# Altium schematic sheet 6_eMMC.SchDoc
size A4
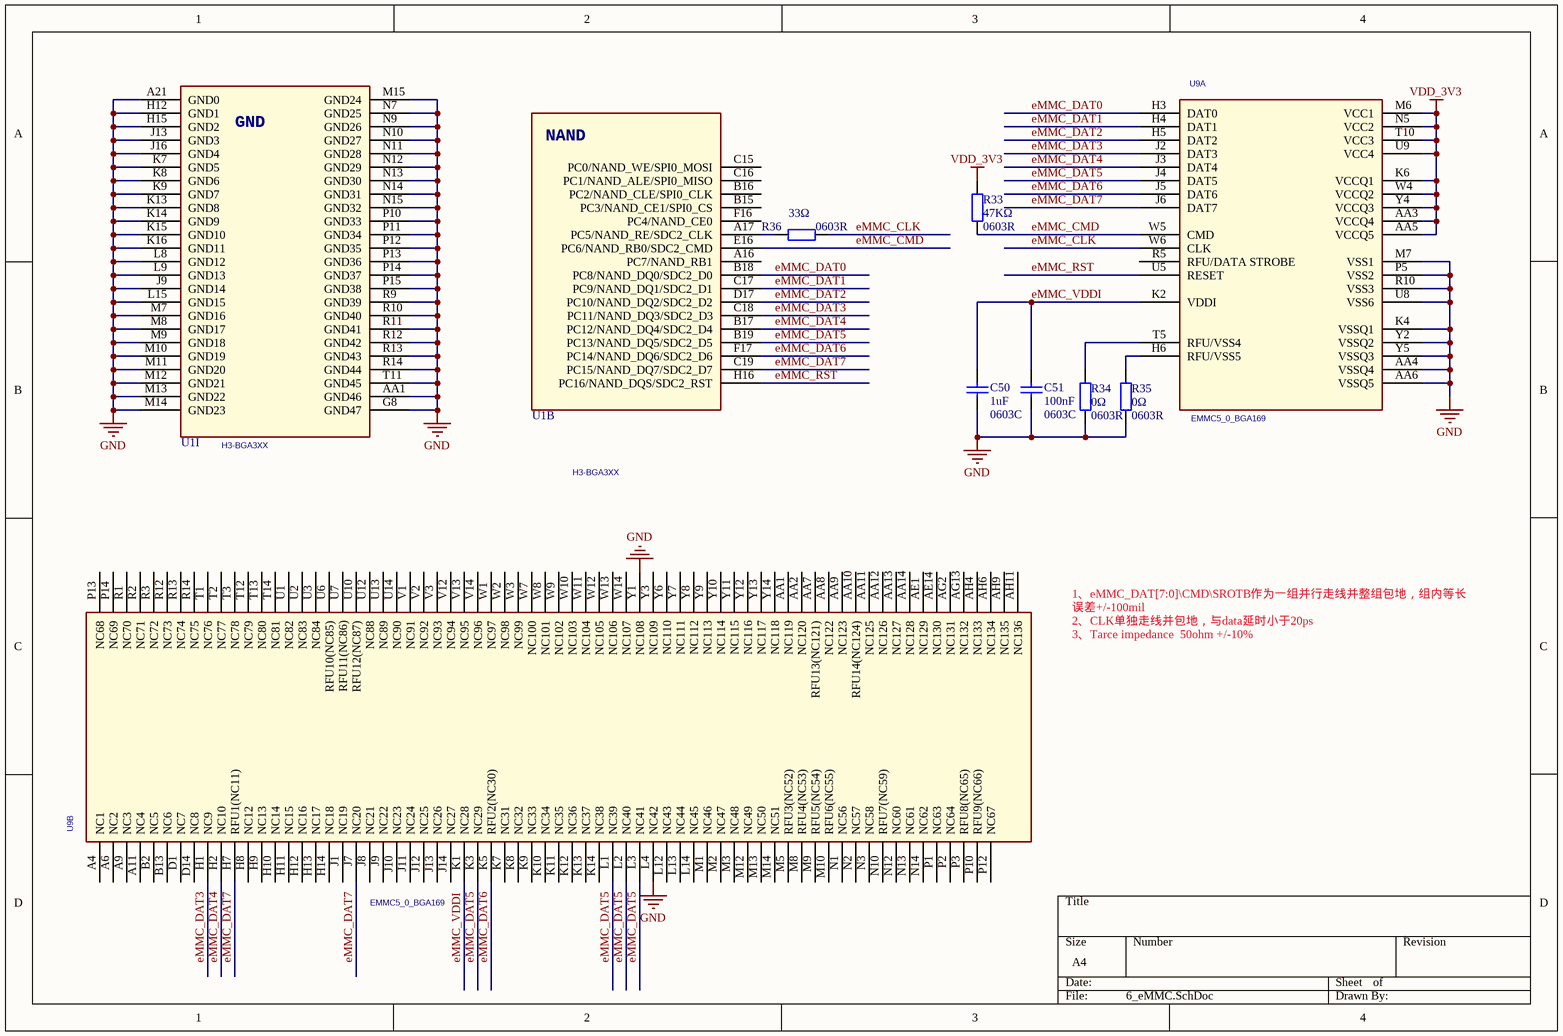
[diagram p0: 6_eMMC.SchDoc]

## Parts
C50  1uF  Package: 0603C  [0603_C]
C51  100nF  Package: 0603C  [0603_C]
R33  47KΩ  Package: 0603R  [0603_R]
R34  0Ω  Package: 0603R  [0603_R]
R35  0Ω  Package: 0603R  [0603_R]
R36  33Ω  Package: 0603R  [0603_R]
U1  H3-BGA3XX  [BGA347P0_65B14X14]  (parts B,I of 9)
U9  EMMC5_0_BGA169  [BGA169P0_50B12_00X16_00H1_00]  (parts A,B of 2)

## Nets
GND: C50.2 C51.2 R34.2 R35.2 U1.A21(GND0) U1.AA1(GND46) U1.G8(GND47) U1.H12(GND1) U1.H15(GND2) U1.J9(GND14) U1.J13(GND3) U1.J16(GND4) U1.K7(GND5) U1.K8(GND6) U1.K9(GND7) U1.K13(GND8) U1.K14(GND9) U1.K15(GND10) U1.K16(GND11) U1.L8(GND12) U1.L9(GND13) U1.L15(GND15) U1.M7(GND16) U1.M8(GND17) U1.M9(GND18) U1.M10(GND19) U1.M11(GND20) U1.M12(GND21) U1.M13(GND22) U1.M14(GND23) U1.M15(GND24) U1.N7(GND25) U1.N9(GND26) U1.N10(GND27) U1.N11(GND28) U1.N12(GND29) U1.N13(GND30) U1.N14(GND31) U1.N15(GND32) U1.P10(GND33) U1.P11(GND34) U1.P12(GND35) U1.P13(GND36) U1.P14(GND37) U1.P15(GND38) U1.R9(GND39) U1.R10(GND40) U1.R11(GND41) U1.R12(GND42) U1.R13(GND43) U1.R14(GND44) U1.T11(GND45) U9.AA4(VSSQ4) U9.AA6(VSSQ5) U9.K4(VSSQ1) U9.L4(NC42) U9.M7(VSS1) U9.P5(VSS2) U9.R10(VSS3) U9.U8(VSS6) U9.Y1(NC108) U9.Y2(VSSQ2) U9.Y5(VSSQ3)
VDD_3V3: R33.1 U9.AA3(VCCQ4) U9.AA5(VCCQ5) U9.K6(VCCQ1) U9.M6(VCC1) U9.N5(VCC2) U9.T10(VCC3) U9.U9(VCC4) U9.W4(VCCQ2) U9.Y4(VCCQ3)
eMMC_CLK: R36.2 U9.W6(CLK)
eMMC_CMD: R33.2 U1.E16(PC6/NAND_RB0/SDC2_CMD) U9.W5(CMD)
eMMC_DAT0: U1.B18(PC8/NAND_DQ0/SDC2_D0) U9.H3(DAT0)
eMMC_DAT1: U1.C17(PC9/NAND_DQ1/SDC2_D1) U9.H4(DAT1)
eMMC_DAT2: U1.D17(PC10/NAND_DQ2/SDC2_D2) U9.H5(DAT2)
eMMC_DAT3: U1.C18(PC11/NAND_DQ3/SDC2_D3) U9.H1(NC9) U9.J2(DAT3)
eMMC_DAT4: U1.B17(PC12/NAND_DQ4/SDC2_D4) U9.H2(NC10) U9.J3(DAT4)
eMMC_DAT5: U1.B19(PC13/NAND_DQ5/SDC2_D5) U9.J4(DAT5) U9.K3(NC29) U9.L1(NC39) U9.L2(NC40) U9.L3(NC41)
eMMC_DAT6: U1.F17(PC14/NAND_DQ6/SDC2_D6) U9.J5(DAT6) U9.K5(RFU2(NC30))
eMMC_DAT7: U1.C19(PC15/NAND_DQ7/SDC2_D7) U9.H7(RFU1(NC11)) U9.J6(DAT7) U9.J7(NC20)
eMMC_RST: U1.H16(PC16/NAND_DQS/SDC2_RST) U9.U5(RESET)
eMMC_VDDI: C50.1 C51.1 U9.K1(NC28) U9.K2(VDDI)
NetR34_1: R34.1 U9.T5(RFU/VSS4)
NetR35_1: R35.1 U9.H6(RFU/VSS5)
NetR36_1: R36.1 U1.A17(PC5/NAND_RE/SDC2_CLK)

Not connected (* = marked no-connect by the designer): U1 A16(PC7/NAND_RB1) B15(PC3/NAND_CE1/SPI0_CS) B16(PC2/NAND_CLE/SPI0_CLK) C15(PC0/NAND_WE/SPI0_MOSI) C16(PC1/NAND_ALE/SPI0_MISO) F16(PC4/NAND_CE0); U9 A4(NC1) A6(NC2) A9(NC3) A11(NC4) AA1(NC119) AA2(NC120) AA7(RFU13(NC121)) AA8(NC122) AA9(NC123) AA10(RFU14(NC124)) AA11(NC125) AA12(NC126) AA13(NC127) AA14(NC128) AE1(NC129) AE14(NC130) AG2(NC131) AG13(NC132) AH4(NC133) AH6(NC134) AH9(NC135) AH11(NC136) B2(NC5) B13(NC6) D1(NC7) D14(NC8) H8(NC12) H9(NC13) H10(NC14) H11(NC15) H12(NC16) H13(NC17) H14(NC18) J1(NC19) J8(NC21) J9(NC22) J10(NC23) J11(NC24) J12(NC25) J13(NC26) J14(NC27) K7(NC31) K8(NC32) K9(NC33) K10(NC34) K11(NC35) K12(NC36) K13(NC37) K14(NC38) L12(NC43) L13(NC44) L14(NC45) M1(NC46) M2(NC47) M3(NC48) M5(RFU3(NC52)) M8(RFU4(NC53)) M9(RFU5(NC54)) M10(RFU6(NC55)) M12(NC49) M13(NC50) M14(NC51) N1(NC56) N2(NC57) N3(NC58) N10(RFU7(NC59)) N12(NC60) N13(NC61) N14(NC62) P1(NC63) P2(NC64) P3(RFU8(NC65)) P10(RFU9(NC66)) P12(NC67) P13(NC68) P14(NC69) R1(NC70) R2(NC71) R3(NC72) R5(RFU/DATA_STROBE) R12(NC73) R13(NC74) R14(NC75) T1(NC76) T2(NC77) T3(NC78) T12(NC79) T13(NC80) T14(NC81) U1(NC82) U2(NC83) U3(NC84) U6(RFU10(NC85)) U7(RFU11(NC86)) U10(RFU12(NC87)) U12(NC88) U13(NC89) U14(NC90) V1(NC91) V2(NC92) V3(NC93) V12(NC94) V13(NC95) V14(NC96) W1(NC97) W2(NC98) W3(NC99) W7(NC100) W8(NC101) W9(NC102) W10(NC103) W11(NC104) W12(NC105) W13(NC106) W14(NC107) Y3(NC109) Y6(NC110) Y7(NC111) Y8(NC112) Y9(NC113) Y10(NC114) Y11(NC115) Y12(NC116) Y13(NC117) Y14(NC118)

## Notes on the sheet
- 1、eMMC_DAT[7:0]\CMD\SROTB作为一组并行走线并整组包地，组内等长误差+/-100mil
  2、CLK单独走线并包地，与data延时小于20ps
  3、Tarce impedance  50ohm +/-10%
- (in symbol H3-BGA3XX, part B) NAND
- (in symbol H3-BGA3XX, part I) GND

## Library data of the parts
C50 C51 = 0402 1nF (102) 10% 50V: 贴片电容; ComponentLink1Description: 供应商链接; ComponentLink1URL: http://www.szlcsc.com/product/details_1875.html; Supplier: LC; SuppliersPartNumber: C1523
R33-R36 = 0402 1KΩ (1001) 1%: 贴片电阻; ComponentLink1Description: 供应商链接; ComponentLink1URL: http://www.szlcsc.com/product/details_12256.html; Supplier: LC; SuppliersPartNumber: C11702